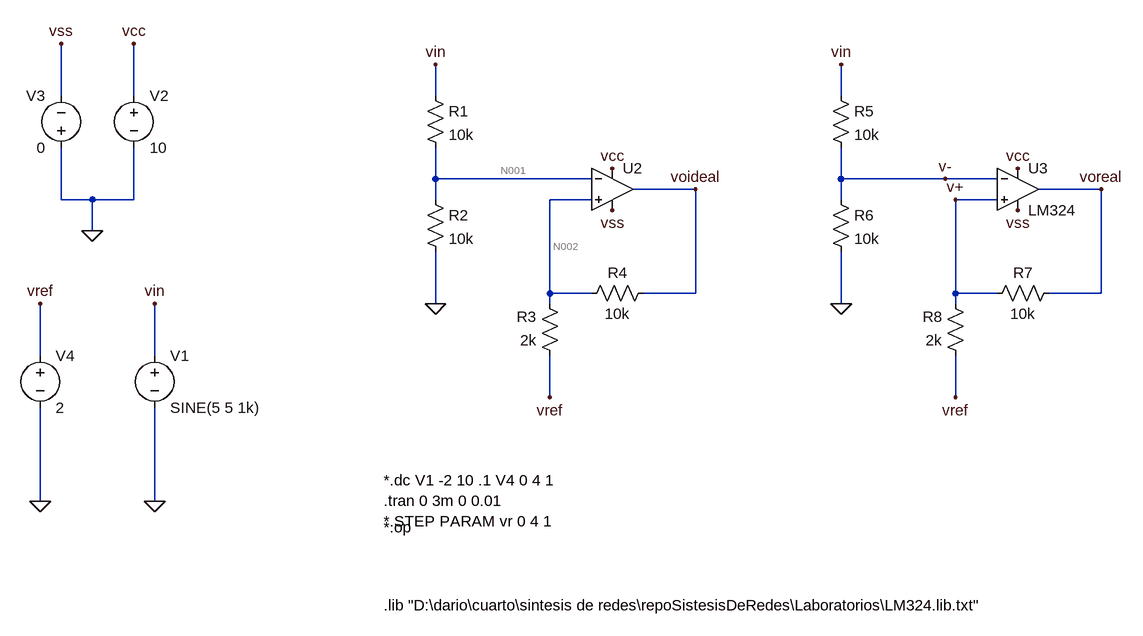
[diagram p0: schematic comparador_Con_Histeresis.asc]
comparador_Con_Histeresis.asc, the LTspice schematic file:
Version 4
SHEET 1 1124 680
WIRE -592 -336 -592 -416
WIRE -480 -336 -480 -416
WIRE -16 -336 -16 -384
WIRE 608 -336 608 -384
WIRE -16 -208 -16 -256
WIRE 224 -208 -16 -208
WIRE 608 -208 608 -256
WIRE 768 -208 608 -208
WIRE 848 -208 768 -208
WIRE 384 -192 288 -192
WIRE 1008 -192 912 -192
WIRE -592 -176 -592 -256
WIRE -544 -176 -592 -176
WIRE -480 -176 -480 -256
WIRE -480 -176 -544 -176
WIRE -16 -176 -16 -208
WIRE 224 -176 160 -176
WIRE 608 -176 608 -208
WIRE 848 -176 784 -176
WIRE -544 -128 -544 -176
WIRE 160 -32 160 -176
WIRE 224 -32 160 -32
WIRE 384 -32 384 -192
WIRE 384 -32 304 -32
WIRE 784 -32 784 -176
WIRE 848 -32 784 -32
WIRE 1008 -32 1008 -192
WIRE 1008 -32 928 -32
WIRE -16 -16 -16 -96
WIRE 160 -16 160 -32
WIRE 608 -16 608 -96
WIRE 784 -16 784 -32
WIRE -624 64 -624 -16
WIRE -448 64 -448 -16
WIRE 160 128 160 64
WIRE 784 128 784 64
WIRE -624 288 -624 144
WIRE -448 288 -448 144
FLAG -544 -128 0
FLAG -592 -416 vss
FLAG -480 -416 vcc
FLAG 256 -160 vss
FLAG 256 -224 vcc
FLAG -448 288 0
FLAG -448 -16 vin
FLAG -16 -16 0
FLAG -16 -384 vin
FLAG 384 -192 voideal
FLAG -624 288 0
FLAG -624 -16 vref
FLAG 160 128 vref
FLAG 880 -160 vss
FLAG 880 -224 vcc
FLAG 608 -16 0
FLAG 608 -384 vin
FLAG 1008 -192 voreal
FLAG 784 128 vref
FLAG 784 -176 v+
FLAG 768 -208 v-
SYMBOL voltage -448 48 R0
WINDOW 123 0 0 Left 0
WINDOW 39 0 0 Left 0
SYMATTR InstName V1
SYMATTR Value SINE(5 5 1k)
SYMBOL voltage -480 -352 R0
WINDOW 123 0 0 Left 0
WINDOW 39 0 0 Left 0
SYMATTR InstName V2
SYMATTR Value 10
SYMBOL voltage -592 -240 R180
WINDOW 0 24 96 Left 2
WINDOW 3 24 16 Left 2
WINDOW 123 0 0 Left 0
WINDOW 39 0 0 Left 0
SYMATTR InstName V3
SYMATTR Value 0
SYMBOL res -32 -352 R0
SYMATTR InstName R1
SYMATTR Value 10k
SYMBOL res -32 -192 R0
SYMATTR InstName R2
SYMATTR Value 10k
SYMBOL res 320 -48 R90
WINDOW 0 0 56 VBottom 2
WINDOW 3 32 56 VTop 2
SYMATTR InstName R4
SYMATTR Value 10k
SYMBOL res 176 80 R180
WINDOW 0 36 76 Left 2
WINDOW 3 36 40 Left 2
SYMATTR InstName R3
SYMATTR Value 2k
SYMBOL voltage -624 48 R0
WINDOW 123 0 0 Left 0
WINDOW 39 0 0 Left 0
SYMATTR InstName V4
SYMATTR Value 2
SYMBOL Opamps\\UniversalOpamp2 256 -192 R0
SYMATTR InstName U2
SYMBOL res 592 -352 R0
SYMATTR InstName R5
SYMATTR Value 10k
SYMBOL res 592 -192 R0
SYMATTR InstName R6
SYMATTR Value 10k
SYMBOL res 944 -48 R90
WINDOW 0 0 56 VBottom 2
WINDOW 3 32 56 VTop 2
SYMATTR InstName R7
SYMATTR Value 10k
SYMBOL res 800 80 R180
WINDOW 0 36 76 Left 2
WINDOW 3 36 40 Left 2
SYMATTR InstName R8
SYMATTR Value 2k
SYMBOL Opamps\\opamp2 880 -256 R0
SYMATTR InstName U3
SYMATTR Value LM324
TEXT -96 448 Left 2 !.lib "D:\\dario\\cuarto\\sintesis de redes\\repoSistesisDeRedes\\Laboratorios\\LM324.lib.txt"
TEXT -96 256 Left 2 !*.dc V1 -2 10 .1 V4 0 4 1\n.tran 0 3m 0 0.01\n*.STEP PARAM vr 0 4 1
TEXT -96 328 Left 2 !*.op

The netlist it stands for:
* comparador_Con_Histeresis.asc
V1 vin 0 SINE(5 5 1k)
V2 vcc 0 10
V3 0 vss 0
R1 vin N001 10k
R2 N001 0 10k
R4 voideal N002 10k
R3 vref N002 2k
V4 vref 0 2
XU2 N002 N001 vcc vss voideal level.2 Avol=1Meg GBW=10Meg Slew=10Meg ilimit=25m rail=0 Vos=0 phimargin=45 en=0 enk=0 in=0 ink=0 Rin=500Meg  ; pins IN+ IN- V+ V- OUT
R5 vin v- 10k
R6 v- 0 10k
R7 voreal v+ 10k
R8 vref v+ 2k
XU3 v+ v- vcc vss voreal LM324  ; pins In+ In- V+ V- OUT
.lib "D:\dario\cuarto\sintesis de redes\repoSistesisDeRedes\Laboratorios\LM324.lib.txt"
*.dc V1 -2 10 .1 V4 0 4 1
.tran 0 3m 0 0.01
*.STEP PARAM vr 0 4 1
*.op
.lib UniversalOpamps2.sub
.backanno
.end

* Results of the author's LTspice run, read from the files saved beside the schematic
* Operating Point, zero values left out:
*   V(vin) = 5 V
*   V(vcc) = 10 V
*   V(n001) = 2.5 V
*   V(voideal) = 5 V
*   V(n002) = 2.5 V
*   V(vref) = 2 V
*   V(v-) = 2.5 V
*   V(voreal) = 5 V
*   V(v+) = 2.5 V
*   I(R8) = -250 µA
*   I(R7) = 250 µA
*   I(R6) = 250 µA
*   I(R5) = 250 µA
*   I(R3) = -250 µA
*   I(R4) = 250 µA
*   I(R2) = 250 µA
*   I(R1) = 250 µA
*   I(V4) = 500 µA
*   I(V3) = -730.4 µA
*   I(V2) = -980.3 µA
*   I(V1) = -500 µA
*   Ix(u2:1) = -5 nA
*   Ix(u2:2) = -5 nA
*   Ix(u2:3) = 640.4 µA
*   Ix(u2:4) = -390.3 µA
*   Ix(u2:5) = -250 µA
*   Ix(u3:1) = -20.22 nA
*   Ix(u3:2) = -20.16 nA
*   Ix(u3:3) = 340 µA
*   Ix(u3:4) = -340 µA
*   Ix(u3:5) = -250 µA
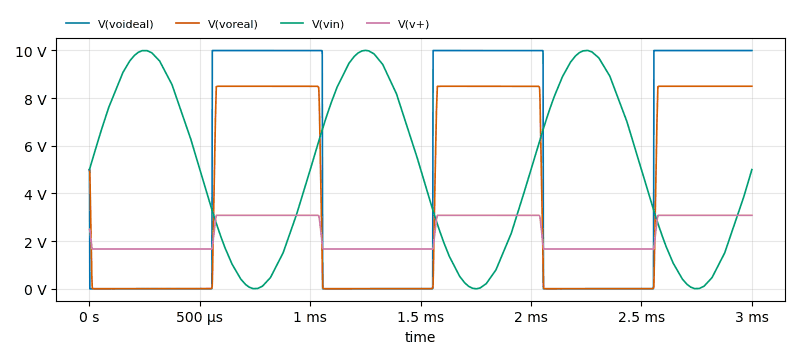
[diagram p1: Transient Analysis of comparador_Con_Histeresis.asc, plotted from the saved traces]
* Transient Analysis, 1 run:
*   V(voideal): min 1.83 mV, max 9.993 V, average 4.813 V, rms 6.932 V, last 9.993 V
*   V(voreal): min 4.296 mV, max 8.496 V, average 3.983 V, rms 5.782 V, last 8.496 V
*   V(vin): min 809 µV, max 10 V, average 4.999 V, rms 6.134 V, last 5 V
*   V(v+): min 1.667 V, max 3.083 V, average 2.331 V, rms 2.433 V, last 3.083 V